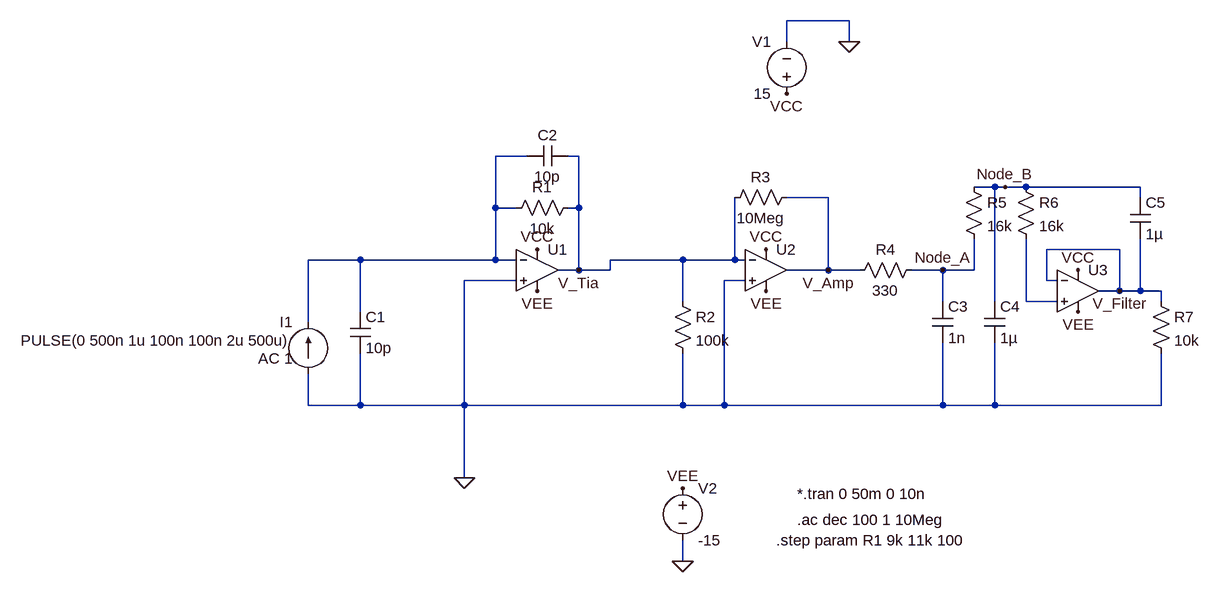
[diagram p0: schematic EE252-File3-PMChannel.asc]
EE252-File3-PMChannel.asc, the LTspice schematic file:
Version 4.1
SHEET 1 2132 680
WIRE 1520 -1136 1424 -1136
WIRE 1424 -1104 1424 -1136
WIRE 1520 -1104 1520 -1136
WIRE 1024 -928 976 -928
WIRE 1104 -928 1088 -928
WIRE 1744 -880 1712 -880
WIRE 1760 -880 1744 -880
WIRE 1792 -880 1760 -880
WIRE 1968 -880 1792 -880
WIRE 1488 -864 1424 -864
WIRE 1968 -864 1968 -880
WIRE 976 -848 976 -928
WIRE 1008 -848 976 -848
WIRE 1104 -848 1104 -928
WIRE 1104 -848 1088 -848
WIRE 1936 -784 1824 -784
WIRE 768 -768 688 -768
WIRE 976 -768 976 -848
WIRE 976 -768 768 -768
WIRE 1008 -768 976 -768
WIRE 1264 -768 1152 -768
WIRE 1344 -768 1344 -864
WIRE 1344 -768 1264 -768
WIRE 1360 -768 1344 -768
WIRE 1104 -752 1104 -848
WIRE 1104 -752 1072 -752
WIRE 1152 -752 1152 -768
WIRE 1152 -752 1104 -752
WIRE 1488 -752 1488 -864
WIRE 1488 -752 1424 -752
WIRE 1536 -752 1488 -752
WIRE 1664 -752 1616 -752
WIRE 1712 -752 1712 -800
WIRE 1712 -752 1664 -752
WIRE 1008 -736 928 -736
WIRE 1360 -736 1328 -736
WIRE 1824 -736 1824 -784
WIRE 1840 -736 1824 -736
WIRE 1936 -720 1936 -784
WIRE 1936 -720 1904 -720
WIRE 1968 -720 1968 -800
WIRE 1968 -720 1936 -720
WIRE 2000 -720 1968 -720
WIRE 1264 -704 1264 -768
WIRE 1664 -704 1664 -752
WIRE 1744 -704 1744 -880
WIRE 1792 -704 1792 -800
WIRE 1840 -704 1792 -704
WIRE 2000 -704 2000 -720
WIRE 768 -688 768 -768
WIRE 688 -672 688 -768
WIRE 688 -544 688 -592
WIRE 768 -544 768 -624
WIRE 768 -544 688 -544
WIRE 928 -544 928 -736
WIRE 928 -544 768 -544
WIRE 1264 -544 1264 -624
WIRE 1264 -544 928 -544
WIRE 1328 -544 1328 -736
WIRE 1328 -544 1264 -544
WIRE 1664 -544 1664 -640
WIRE 1664 -544 1328 -544
WIRE 1744 -544 1744 -640
WIRE 1744 -544 1664 -544
WIRE 2000 -544 2000 -624
WIRE 2000 -544 1744 -544
WIRE 928 -432 928 -544
WIRE 1264 -304 1264 -336
FLAG 928 -432 0
FLAG 1104 -752 V_Tia
FLAG 1488 -752 V_Amp
FLAG 1760 -880 Node_B
FLAG 1936 -720 V_Filter
FLAG 1520 -1104 0
FLAG 1664 -752 Node_A
FLAG 1424 -1024 VCC
FLAG 1392 -784 VCC
FLAG 1872 -752 VCC
FLAG 1040 -784 VCC
FLAG 1040 -720 VEE
FLAG 1392 -720 VEE
FLAG 1872 -688 VEE
FLAG 1264 -304 0
FLAG 1264 -416 VEE
SYMBOL OpAmps\\UniversalOpAmp2 1040 -752 R0
SYMATTR InstName U1
SYMATTR Value2 Avol=1Meg GBW=1Meg Slew=10Meg
SYMATTR SpiceLine2 En=0 Enk=0 In=0 Ink=0 Rin=1T
SYMBOL res 1104 -864 R90
WINDOW 0 0 56 VBottom 2
WINDOW 3 32 56 VTop 2
SYMATTR InstName R1
SYMATTR Value 10k
SYMBOL cap 1088 -944 R90
WINDOW 0 0 32 VBottom 2
WINDOW 3 32 32 VTop 2
SYMATTR InstName C2
SYMATTR Value 10p
SYMBOL OpAmps\\UniversalOpAmp2 1392 -752 R0
SYMATTR InstName U2
SYMATTR Value2 Avol=1Meg GBW=1G Slew=10Meg
SYMATTR SpiceLine2 En=0 Enk=0 In=0 Ink=0 Rin=1T
SYMBOL res 1440 -880 R90
WINDOW 0 0 56 VBottom 2
WINDOW 3 32 56 VTop 2
SYMATTR InstName R3
SYMATTR Value 10Meg
SYMBOL res 1696 -896 R0
SYMATTR InstName R5
SYMATTR Value 16k
SYMBOL res 1776 -896 R0
SYMATTR InstName R6
SYMATTR Value 16k
SYMBOL OpAmps\\UniversalOpAmp2 1872 -720 R0
SYMATTR InstName U3
SYMATTR Value2 Avol=1Meg GBW=1Meg Slew=10Meg
SYMATTR SpiceLine2 En=0 Enk=0 In=0 Ink=0 Rin=1T
SYMBOL res 1984 -720 R0
SYMATTR InstName R7
SYMATTR Value 10k
SYMBOL voltage 1424 -1008 R180
WINDOW 0 24 96 Left 2
WINDOW 3 24 16 Left 2
SYMATTR InstName V1
SYMATTR Value 15
SYMBOL cap 752 -688 R0
SYMATTR InstName C1
SYMATTR Value 10p
SYMBOL res 1632 -768 R90
WINDOW 0 0 56 VBottom 2
WINDOW 3 32 56 VTop 2
SYMATTR InstName R4
SYMATTR Value 330
SYMBOL cap 1648 -704 R0
SYMATTR InstName C3
SYMATTR Value 1n
SYMBOL cap 1728 -704 R0
SYMATTR InstName C4
SYMATTR Value 1µ
SYMBOL cap 1952 -864 R0
SYMATTR InstName C5
SYMATTR Value 1µ
SYMBOL voltage 1264 -432 R0
SYMATTR InstName V2
SYMATTR Value -15
SYMBOL res 1248 -720 R0
SYMATTR InstName R2
SYMATTR Value 100k
SYMBOL current 688 -592 R180
WINDOW 0 24 80 Left 2
WINDOW 3 24 52 Left 2
WINDOW 123 24 24 Left 2
WINDOW 39 0 0 Left 0
SYMATTR InstName I1
SYMATTR Value PULSE(0 500n 1u 100n 100n 2u 500u)
SYMATTR Value2 AC 1
TEXT 1440 -368 Left 2 !.ac dec 100 1 10Meg
TEXT 1440 -408 Left 2 !*.tran 0 50m 0 10n
TEXT 1408 -336 Left 2 !.step param R1 9k 11k 100

The netlist it stands for:
* EE252-File3-PMChannel.asc
X§U1 0 N001 VCC VEE V_Tia level2 Avol=1Meg GBW=1Meg Slew=10Meg Ilimit=25m Rail=0 Vos=0 En=0 Enk=0 In=0 Ink=0 Rin=1T  ; pins In+ In- V+ V- OUT
R1 V_Tia N001 10k
C2 V_Tia N001 10p
X§U2 0 V_Tia VCC VEE V_Amp level2 Avol=1Meg GBW=1G Slew=10Meg Ilimit=25m Rail=0 Vos=0 En=0 Enk=0 In=0 Ink=0 Rin=1T  ; pins In+ In- V+ V- OUT
R3 V_Amp V_Tia 10Meg
R5 Node_B Node_A 16k
R6 Node_B N002 16k
X§U3 N002 V_Filter VCC VEE V_Filter level2 Avol=1Meg GBW=1Meg Slew=10Meg Ilimit=25m Rail=0 Vos=0 En=0 Enk=0 In=0 Ink=0 Rin=1T  ; pins In+ In- V+ V- OUT
R7 V_Filter 0 10k
V1 VCC 0 15
C1 N001 0 10p
R4 Node_A V_Amp 330
C3 Node_A 0 1n
C4 Node_B 0 1µ
C5 Node_B V_Filter 1µ
V2 VEE 0 -15
R2 V_Tia 0 100k
I1 0 N001 PULSE(0 500n 1u 100n 100n 2u 500u) AC 1
.ac dec 100 1 10Meg
*.tran 0 50m 0 10n
.step param R1 9k 11k 100
.lib UniversalOpAmp2.lib
.backanno
.end